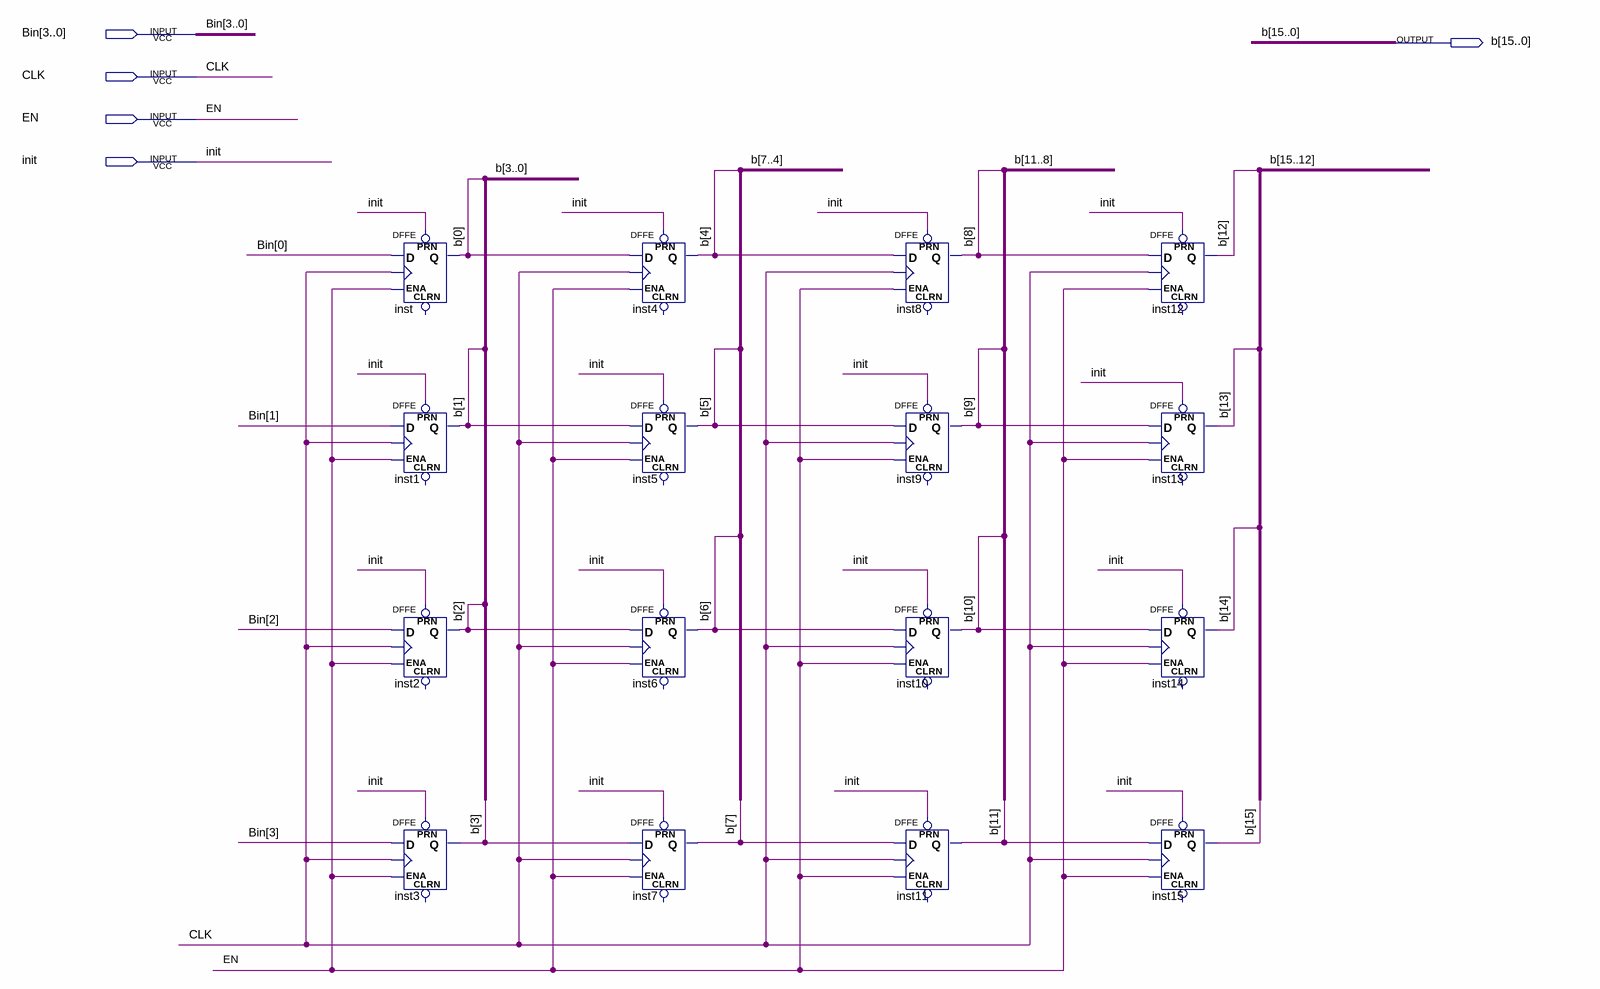
[diagram p0: schematic sheet]
// Quartus schematic bangoRegister.bdf as structural Verilog: 16 symbols, 5 pins
module bangoRegister (
  input  [3:0] Bin,
  input  CLK,
  input  EN,
  input  init,
  output [15:0] b
);

  DFFE inst (.PRN(init), .D(Bin[0]), .CLK(CLK), .ENA(EN), .Q(b[0]));  // open: CLRN
  DFFE inst1 (.PRN(init), .D(Bin[1]), .CLK(CLK), .ENA(EN), .Q(b[1]));  // open: CLRN
  DFFE inst2 (.PRN(init), .D(Bin[2]), .CLK(CLK), .ENA(EN), .Q(b[2]));  // open: CLRN
  DFFE inst3 (.PRN(init), .D(Bin[3]), .CLK(CLK), .ENA(EN), .Q(b[3]));  // open: CLRN
  DFFE inst4 (.PRN(init), .D(b[0]), .CLK(CLK), .ENA(EN), .Q(b[4]));  // open: CLRN
  DFFE inst5 (.PRN(init), .D(b[1]), .CLK(CLK), .ENA(EN), .Q(b[5]));  // open: CLRN
  DFFE inst6 (.PRN(init), .D(b[2]), .CLK(CLK), .ENA(EN), .Q(b[6]));  // open: CLRN
  DFFE inst7 (.PRN(init), .D(b[3]), .CLK(CLK), .ENA(EN), .Q(b[7]));  // open: CLRN
  DFFE inst8 (.PRN(init), .D(b[4]), .CLK(CLK), .ENA(EN), .Q(b[8]));  // open: CLRN
  DFFE inst9 (.PRN(init), .D(b[5]), .CLK(CLK), .ENA(EN), .Q(b[9]));  // open: CLRN
  DFFE inst10 (.PRN(init), .D(b[6]), .CLK(CLK), .ENA(EN), .Q(b[10]));  // open: CLRN
  DFFE inst11 (.PRN(init), .D(b[7]), .CLK(CLK), .ENA(EN), .Q(b[11]));  // open: CLRN
  DFFE inst12 (.PRN(init), .D(b[8]), .CLK(CLK), .ENA(EN), .Q(b[12]));  // open: CLRN
  DFFE inst13 (.PRN(init), .D(b[9]), .CLK(CLK), .ENA(EN), .Q(b[13]));  // open: CLRN
  DFFE inst14 (.PRN(init), .D(b[10]), .CLK(CLK), .ENA(EN), .Q(b[14]));  // open: CLRN
  DFFE inst15 (.PRN(init), .D(b[11]), .CLK(CLK), .ENA(EN), .Q(b[15]));  // open: CLRN
endmodule
